# Altium schematic sheet PMIC.SchDoc
size A3; SheetNumber: 3; SheetTotal: 12
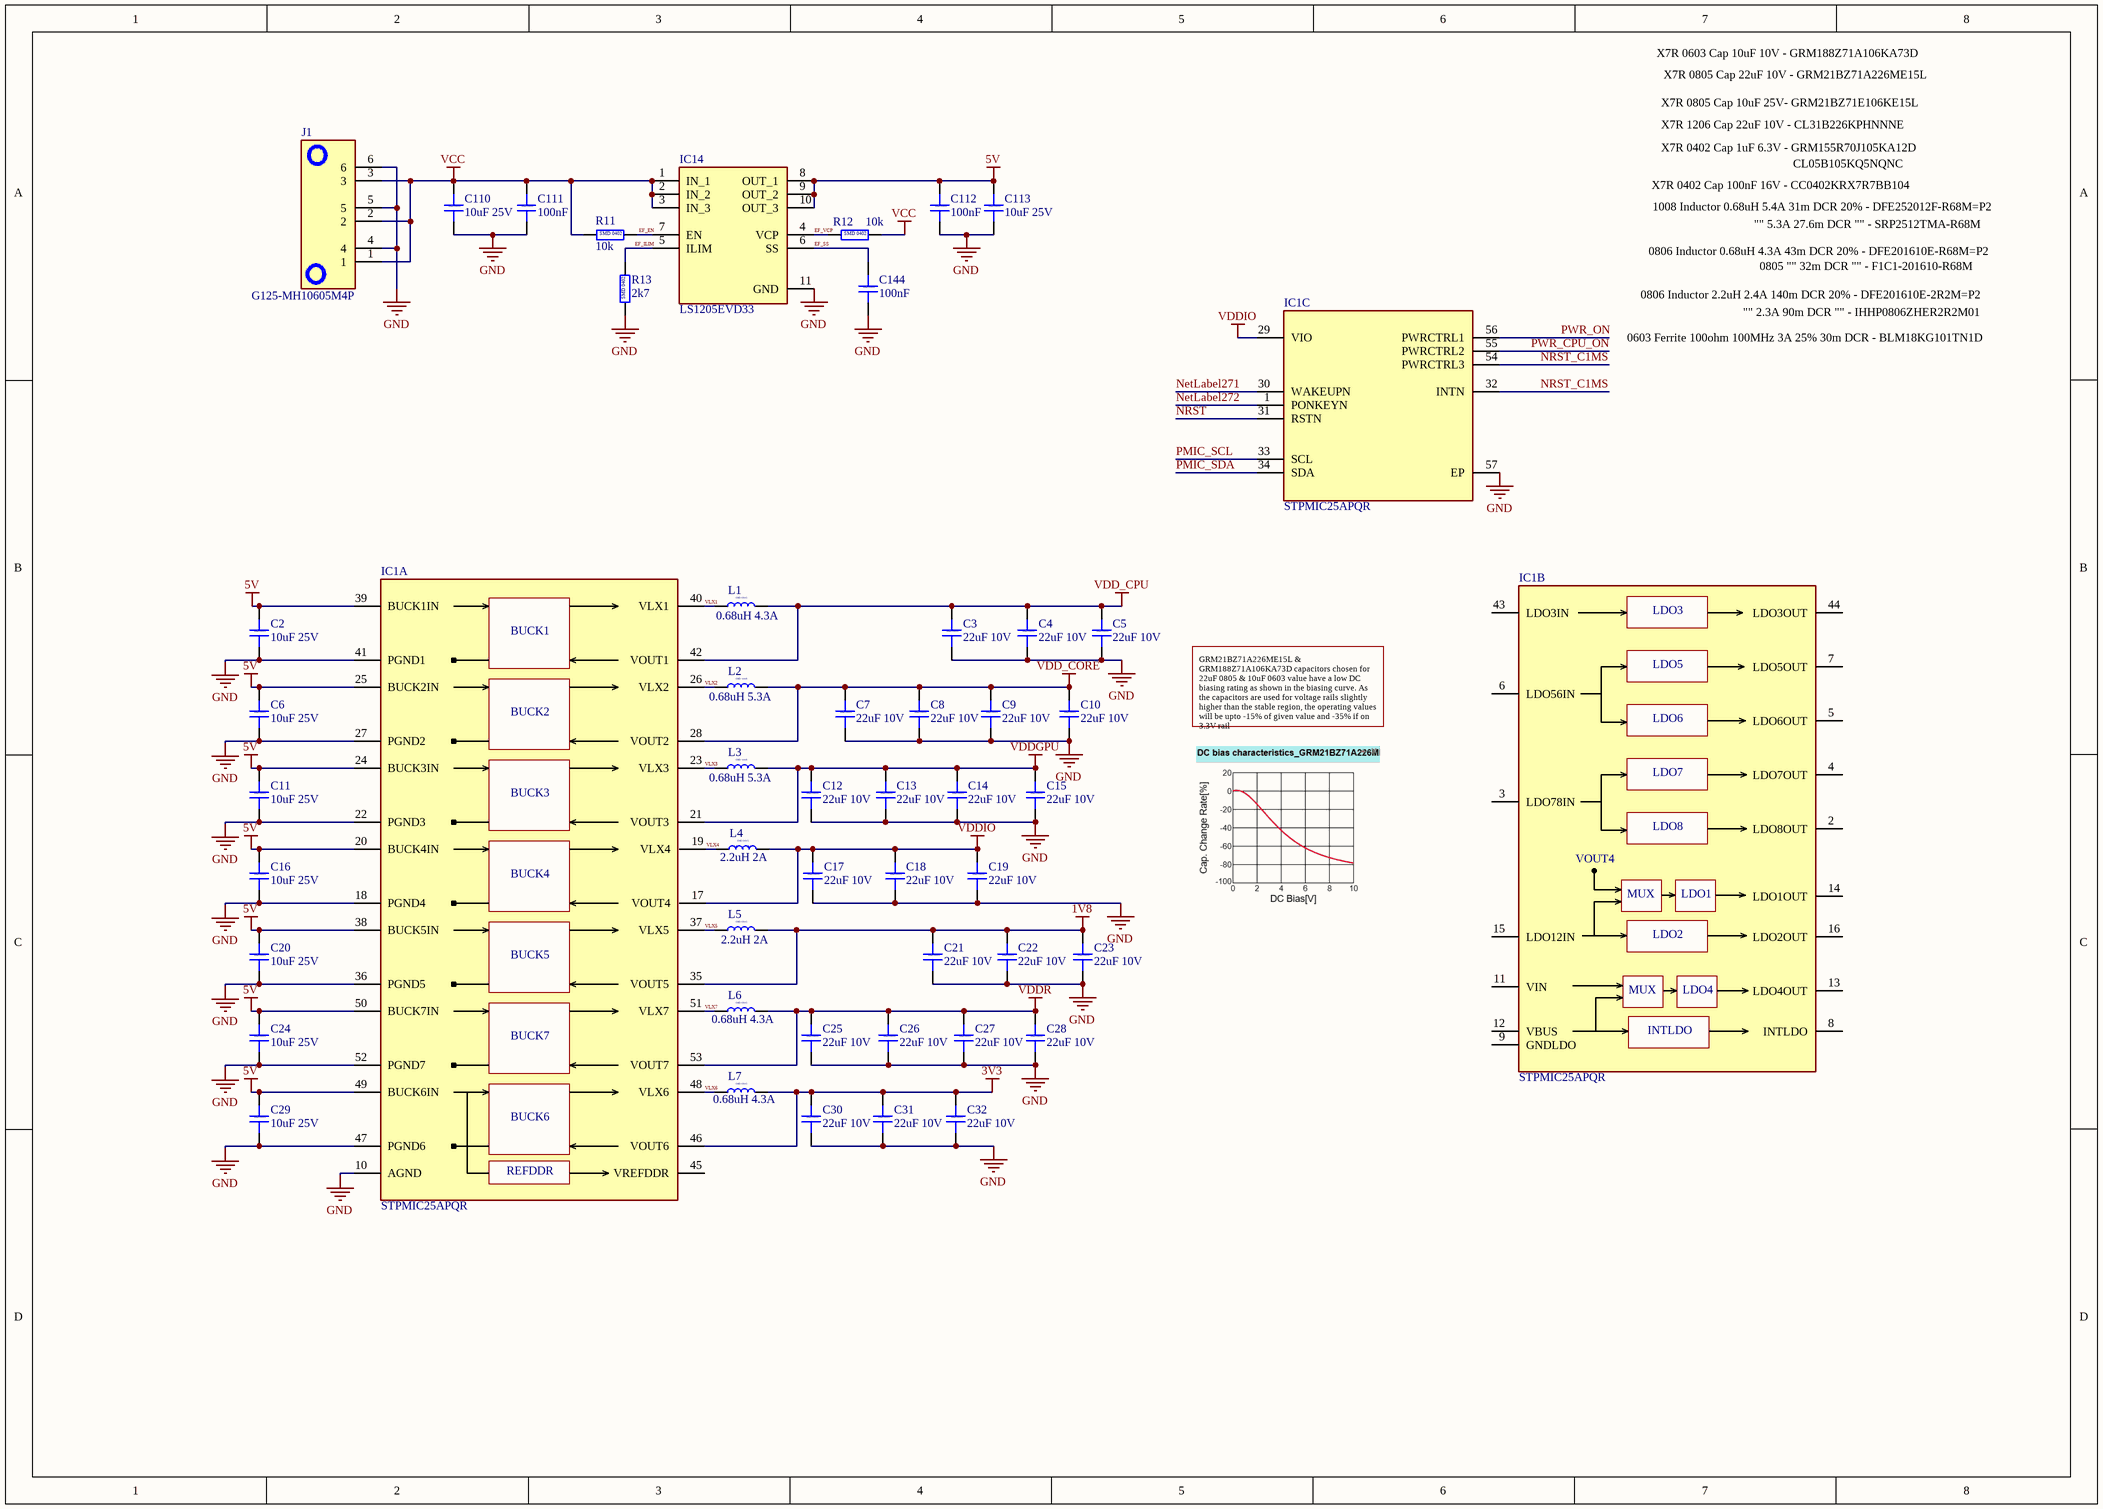
[diagram p0: PMIC.SchDoc]

## Parts
C2  10uF 25V  [CAP_0805]
C3  22uF 10V  [CAP_0805]
C4  22uF 10V  [CAP_0805]
C5  22uF 10V  [CAP_0805]
C6  10uF 25V  [CAP_0805]
C7  22uF 10V  [CAP_0805]
C8  22uF 10V  [CAP_0805]
C9  22uF 10V  [CAP_0805]
C10  22uF 10V  [CAP_0805]
C11  10uF 25V  [CAP_0805]
C12  22uF 10V  [CAP_0805]
C13  22uF 10V  [CAP_0805]
C14  22uF 10V  [CAP_0805]
C15  22uF 10V  [CAP_0805]
C16  10uF 25V  [CAP_0805]
C17  22uF 10V  [CAP_0805]
C18  22uF 10V  [CAP_0805]
C19  22uF 10V  [CAP_0805]
C20  10uF 25V  [CAP_0805]
C21  22uF 10V  [CAP_0805]
C22  22uF 10V  [CAP_0805]
C23  22uF 10V  [CAP_0805]
C24  10uF 25V  [CAP_0805]
C25  22uF 10V  [CAP_0805]
C26  22uF 10V  [CAP_0805]
C27  22uF 10V  [CAP_0805]
C28  22uF 10V  [CAP_0805]
C29  10uF 25V  [CAP_0805]
C30  22uF 10V  [CAP_0805]
C31  22uF 10V  [CAP_0805]
C32  22uF 10V  [CAP_0805]
C110  10uF 25V  [CAP_0805]
C111  100nF  [CAP_0402]
C112  100nF  [CAP_0402]
C113  10uF 25V  [CAP_0805]
C144  100nF  [CAP_0402]
IC1  STPMIC25APQR  [QFN40P650X650X90-57N-D]  (parts A,B,C of 3)
IC14  LS1205EVD33  [LS1205EVD33]
J1  G125-MH10605M4P  [G125-MH10605M4P_1]
L1  0.68uH 4.3A  [DFE2HCAH1R0MJ0L]
L2  0.68uH 5.3A  [1285ASH1R0MP2]
L3  0.68uH 5.3A  [1285ASH1R0MP2]
L4  2.2uH 2A  [DFE2HCAH1R0MJ0L]
L5  2.2uH 2A  [DFE2HCAH1R0MJ0L]
L6  0.68uH 4.3A  [DFE2HCAH1R0MJ0L]
L7  0.68uH 4.3A  [DFE2HCAH1R0MJ0L]
R11  10k  [RES_0402]
R12  10k  [RES_0402]
R13  2k7  [RES_0402]

## Nets
1V8: C21.1 C22.1 C23.1 IC1.35(VOUT5) L5.2
3V3: C30.1 C31.1 C32.1 IC1.46(VOUT6) L7.2
5V: C2.1 C6.1 C11.1 C16.1 C20.1 C24.1 C29.1 C112.1 C113.1 IC1.20(BUCK4IN) IC1.24(BUCK3IN) IC1.25(BUCK2IN) IC1.38(BUCK5IN) IC1.39(BUCK1IN) IC1.49(BUCK6IN) IC1.50(BUCK7IN) IC14.8(OUT_1) IC14.9(OUT_2) IC14.10(OUT_3)
GND: C2.2 C3.2 C4.2 C5.2 C6.2 C7.2 C8.2 C9.2 C10.2 C11.2 C12.2 C13.2 C14.2 C15.2 C16.2 C17.2 C18.2 C19.2 C20.2 C21.2 C22.2 C23.2 C24.2 C25.2 C26.2 C27.2 C28.2 C29.2 C30.2 C31.2 C32.2 C110.2 C111.2 C112.2 C113.2 C144.2 IC1.10(AGND) IC1.18(PGND4) IC1.22(PGND3) IC1.27(PGND2) IC1.36(PGND5) IC1.41(PGND1) IC1.47(PGND6) IC1.52(PGND7) IC1.57(EP) IC14.11(GND) J1.4 J1.5 J1.6 R13.1
VCC: C110.1 C111.1 IC14.1(IN_1) IC14.2(IN_2) IC14.3(IN_3) J1.1 J1.2 J1.3 R11.1 R12.2
VDD_CORE: C7.1 C8.1 C9.1 C10.1 IC1.28(VOUT2) L2.2
VDD_CPU: C3.1 C4.1 C5.1 IC1.42(VOUT1) L1.2
VDDGPU: C12.1 C13.1 C14.1 C15.1 IC1.21(VOUT3) L3.2
VDDIO: C17.1 C18.1 C19.1 IC1.17(VOUT4) IC1.29(VIO) L4.2
VDDR: C25.1 C26.1 C27.1 C28.1 IC1.53(VOUT7) L6.2
EF_EN: IC14.7(EN) R11.2
EF_ILIM: IC14.5(ILIM) R13.2
EF_SS: C144.1 IC14.6(SS)
EF_VCP: IC14.4(VCP) R12.1
NetLabel271: IC1.30(WAKEUPN)
NetLabel272: IC1.1(PONKEYN)
NRST: IC1.31(RSTN)
NRST_C1MS: IC1.32(INTN) IC1.54(PWRCTRL3)
PMIC_SCL: IC1.33(SCL)
PMIC_SDA: IC1.34(SDA)
PWR_CPU_ON: IC1.55(PWRCTRL2)
PWR_ON: IC1.56(PWRCTRL1)
VLX1: IC1.40(VLX1) L1.1
VLX2: IC1.26(VLX2) L2.1
VLX3: IC1.23(VLX3) L3.1
VLX4: IC1.19(VLX4) L4.1
VLX5: IC1.37(VLX5) L5.1
VLX6: IC1.48(VLX6) L7.1
VLX7: IC1.51(VLX7) L6.1

Not connected (* = marked no-connect by the designer): IC1 2(LDO8OUT) 3(LDO78IN) 4(LDO7OUT) 5(LDO6OUT) 6(LDO56IN) 7(LDO5OUT) 8(INTLDO) 9(GNDLDO) 11(VIN) 12(VBUS) 13(LDO4OUT) 14(LDO1OUT) 15(LDO12IN) 16(LDO2OUT) 43(LDO3IN) 44(LDO3OUT) 45(VREFDDR)

## Notes on the sheet
- X7R 0603 Cap 10uF 10V - GRM188Z71A106KA73D
- X7R 0805 Cap 10uF 25V- GRM21BZ71E106KE15L
- X7R 0805 Cap 22uF 10V - GRM21BZ71A226ME15L
- X7R 1206 Cap 22uF 10V - CL31B226KPHNNNE
- X7R 0402 Cap 1uF 6.3V - GRM155R70J105KA12D
- CL05B105KQ5NQNC
- X7R 0402 Cap 100nF 16V - CC0402KRX7R7BB104
- 1008 Inductor 0.68uH 5.4A 31m DCR 20% - DFE252012F-R68M=P2
- "" 5.3A 27.6m DCR "" - SRP2512TMA-R68M
- 0806 Inductor 2.2uH 2.4A 140m DCR 20% - DFE201610E-2R2M=P2
- 0806 Inductor 0.68uH 4.3A 43m DCR 20% - DFE201610E-R68M=P2
- "" 2.3A 90m DCR "" - IHHP0806ZHER2R2M01
- 0805 "" 32m DCR "" - F1C1-201610-R68M
- 0603 Ferrite 100ohm 100MHz 3A 25% 30m DCR - BLM18KG101TN1D
- GRM21BZ71A226ME15L & GRM188Z71A106KA73D capacitors chosen for 22uF 0805 & 10uF 0603 value have a low DC biasing rating as shown in the biasing curve. As the capacitors are used for voltage rails slightly higher than the stable region, the operating values will be upto -15% of given value and -35% if on 3.3V rail
- (in symbol Capacitor-SMD-0402) SMD 0402
- (in symbol Capacitor-SMD-0805) SMD 0805
- (in symbol Inductor-SMD-RF-0806/0805) SMD 0805
- (in symbol Inductor-SMD-RF-1008) SMD 1008
- (in symbol Resistor-SMD-0402) SMD 0402
- (in symbol STPMIC25APQR, part A) BUCK1; BUCK2; BUCK3; BUCK4; BUCK5; BUCK7; BUCK6; REFDDR
- (in symbol STPMIC25APQR, part B) LDO3; LDO5; LDO6; LDO7; LDO8; MUX; LDO1; LDO2; LDO4

## Library data of the parts
C2-C32 C110 C113 = Capacitor-SMD-0805: Capacitor SMD 0805 RATED
C111 C112 C144 = Capacitor-SMD-0402: Capacitor SMD 0402 RATED
IC1 = STPMIC25APQR: Integrated Circuit; Manufacturer_Name: STMicroelectronics; Datasheet Link: https://www.st.com/resource/en/datasheet/stpmic25.pdf; Height: 0.9mm; Manufacturer_Part_Number: STPMIC25APQR; Mouser Part Number: 511-STPMIC25APQR; Mouser Price/Stock: https://www.mouser.co.uk/ProductDetail/STMicroelectronics/STPMIC25APQR?qs=jRuttqqUwMR8b%2FyHW8MhFQ%3D%3D; Arrow Part Number: STPMIC25APQR; Arrow Price/Stock: https://www.arrow.com/en/products/stpmic25apqr/stmicroelectronics?utm_currency=USD&region=europe
IC14 = LS1205EVD33: Integrated Circuit; Manufacturer_Name: LITTELFUSE; Datasheet Link: https://www.littelfuse.com/media?resourcetype=datasheets&itemid=b40a8809-c1ad-459d-a34c-84532dbddcb7&filename=littelfuse-protection-ic-ls1205exd33--datasheet; Height: 0.8mm; Manufacturer_Part_Number: LS1205EVD33; Mouser Part Number: 576-LS1205EVD33; Mouser Price/Stock: https://www.mouser.co.uk/ProductDetail/Littelfuse/LS1205EVD33?qs=4ASt3YYao0VRtislHe5uQQ%3D%3D; Arrow Part Number: LS1205EVD33; Arrow Price/Stock: https://www.arrow.com/en/products/ls1205evd33/littelfuse?utm_currency=USD&region=nac
J1 = G125-MH10605M4P: Connector; Manufacturer_Name: Harwin; Datasheet Link: https://content.harwin.com/m/667f1be9427fb768/original/DRG-02921-Technical-Drawing-Datasheet-G125-MH1XX05M4P-pdf.pdf; Height: 5.3mm; Manufacturer_Part_Number: G125-MH10605M4P; Mouser Part Number: 855-G125MH1065M4PM4P; Mouser Price/Stock: https://www.mouser.co.uk/ProductDetail/Harwin/G125-MH10605M4P?qs=vHuUswq2%252BswF07IXFR1W6A%3D%3D
L1 L4-L7 = Inductor-SMD-RF-0806/0805: Inductor SMD 0805
L2 L3 = Inductor-SMD-RF-1008: Inductor SMD 1008
R11-R13 = Resistor-SMD-0402: Resistor SMD 0402 RATED